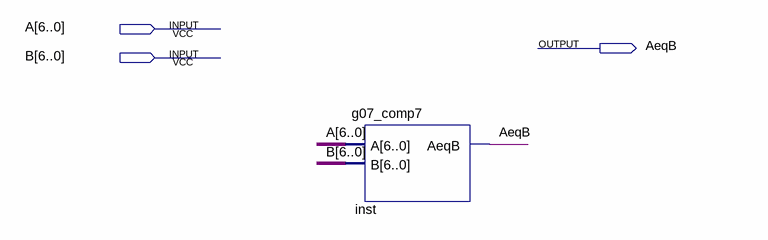
[diagram p0: schematic sheet]
// Quartus schematic g07_lab1.bdf as structural Verilog: 1 symbols, 3 pins
module g07_lab1 (
  input  [6:0] A,
  input  [6:0] B,
  output AeqB
);

  g07_comp7 inst (.A(A), .B(B), .AeqB(AeqB));
endmodule
